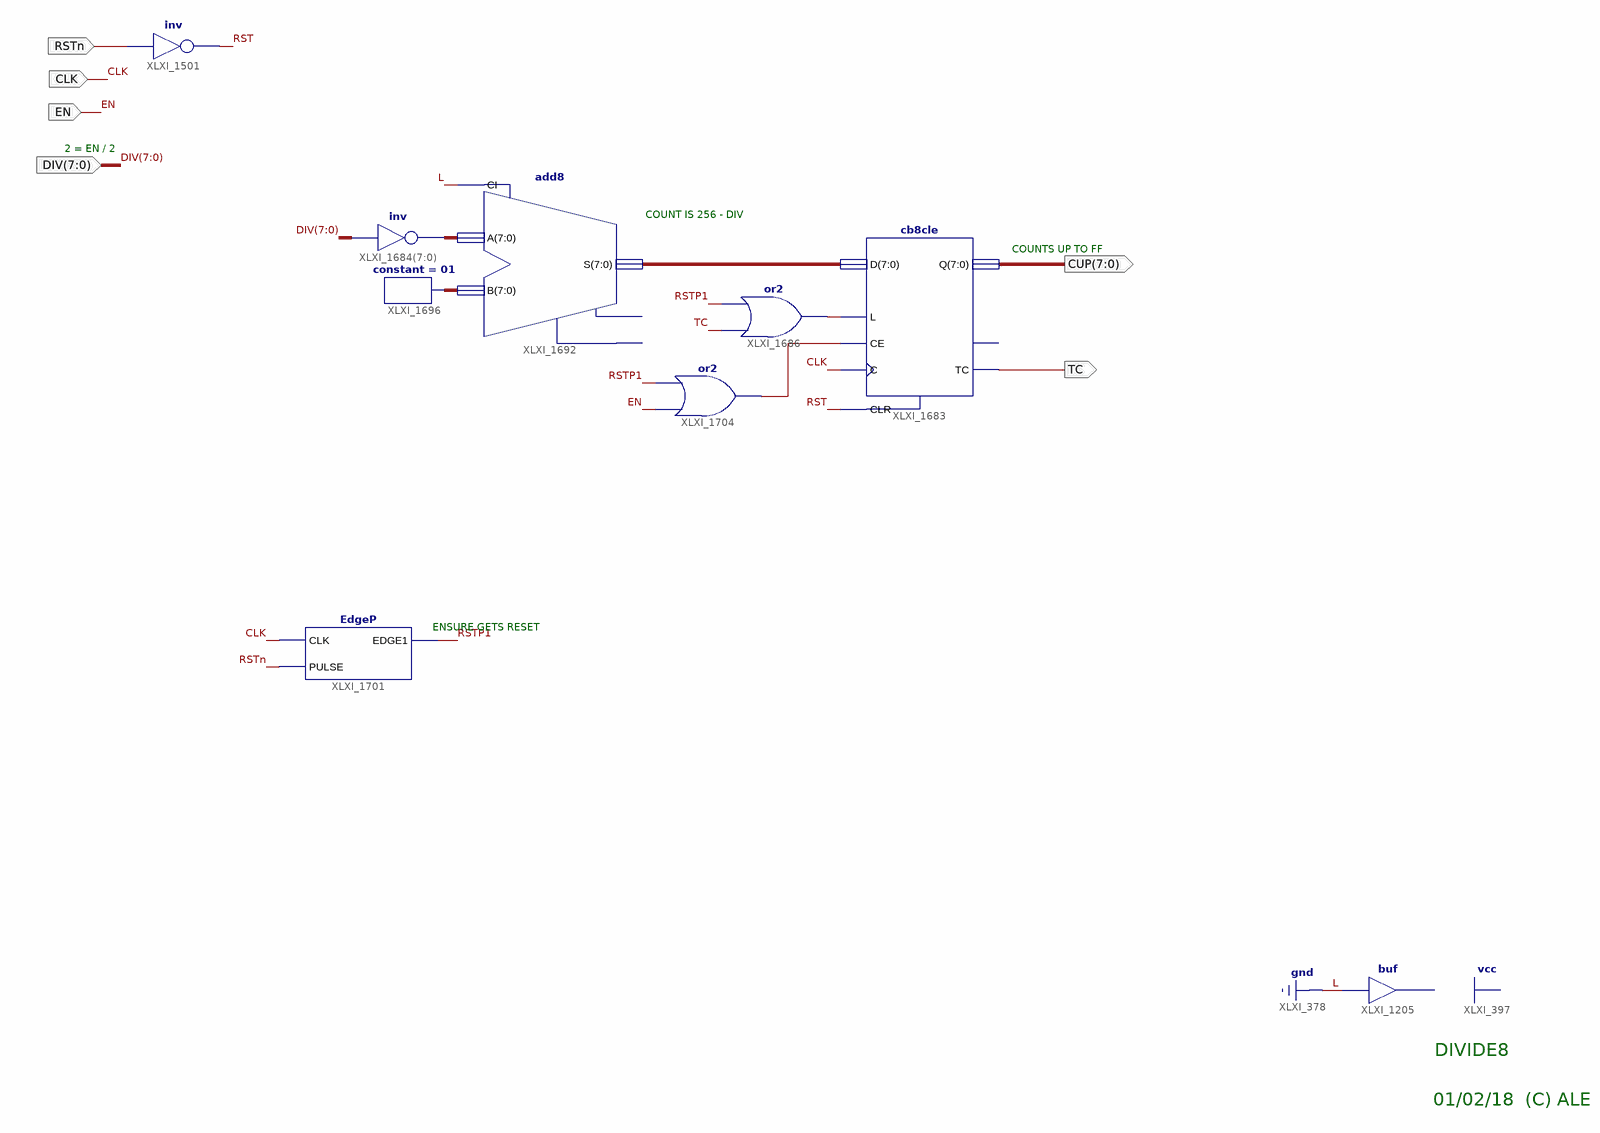
[diagram p0: schematic sheet 1]
// Xilinx ISE schematic Divide8.sch (aspartan3e) as structural Verilog: 9 symbols, 6 ports
module Divide8 (
  input  CLK,
  input  RSTn,
  input  [7:0] DIV,
  input  EN,
  output TC,
  output [7:0] CUP
);

  wire RST, RSTP1, XLXN_28, XLXN_70;
  wire [7:0] XLXN_53, XLXN_55, XLXN_57;

  not XLXI_1501 (RST, RSTn);
  // buf XLXI_1205 has open pins: I=1'b0, O=open
  add8 XLXI_1692 (.A(XLXN_55), .B(XLXN_57), .CI(1'b0), .S(XLXN_53));  // open: CO, OFL
  cb8cle XLXI_1683 (.C(CLK), .CE(XLXN_70), .CLR(RST), .D(XLXN_53), .L(XLXN_28), .Q(CUP), .TC(TC));  // open: CEO
  or XLXI_1686 (XLXN_28, TC, RSTP1);
  assign XLXN_55 = ~DIV;  // inv XLXI_1684[7..0], 8 bits wide
  constant #(.CValue("01")) XLXI_1696 (.O(XLXN_57));
  EdgeP XLXI_1701 (.CLK(CLK), .EDGE1(RSTP1), .PULSE(RSTn));
  or XLXI_1704 (XLXN_70, EN, RSTP1);

  // Notes on the sheet:
  //   2 = EN / 2
  //   COUNT IS 256 - DIV
  //   COUNTS UP TO FF
  //   ENSURE GETS RESET
  //   DIVIDE8
  //   01/02/18  (C) ALE
endmodule
